# EAGLE board CFT-PB0-revD-TSSOP (EAGLE 5.11), part 1 of 2
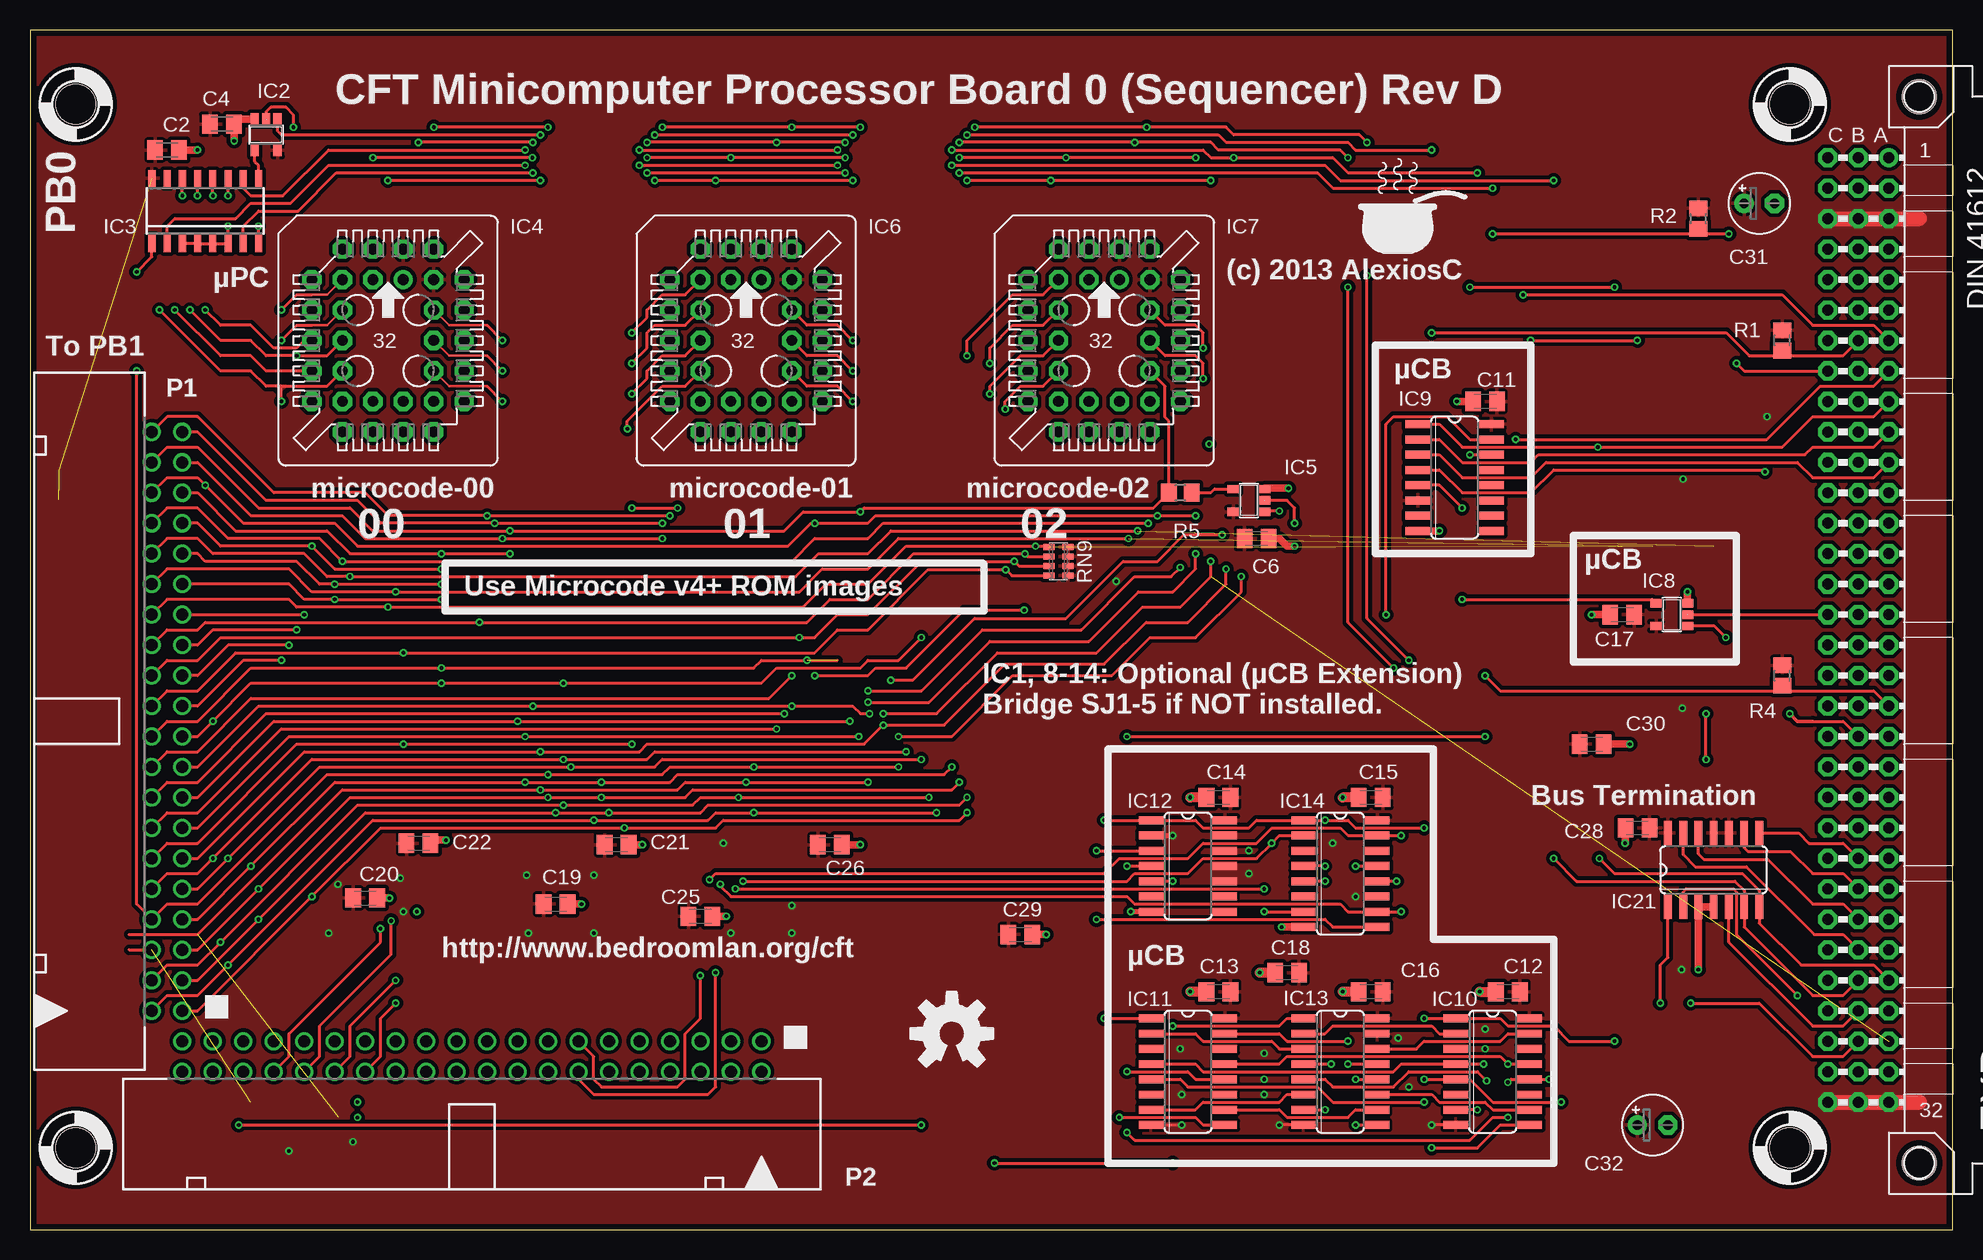
[diagram p5: board, top side]
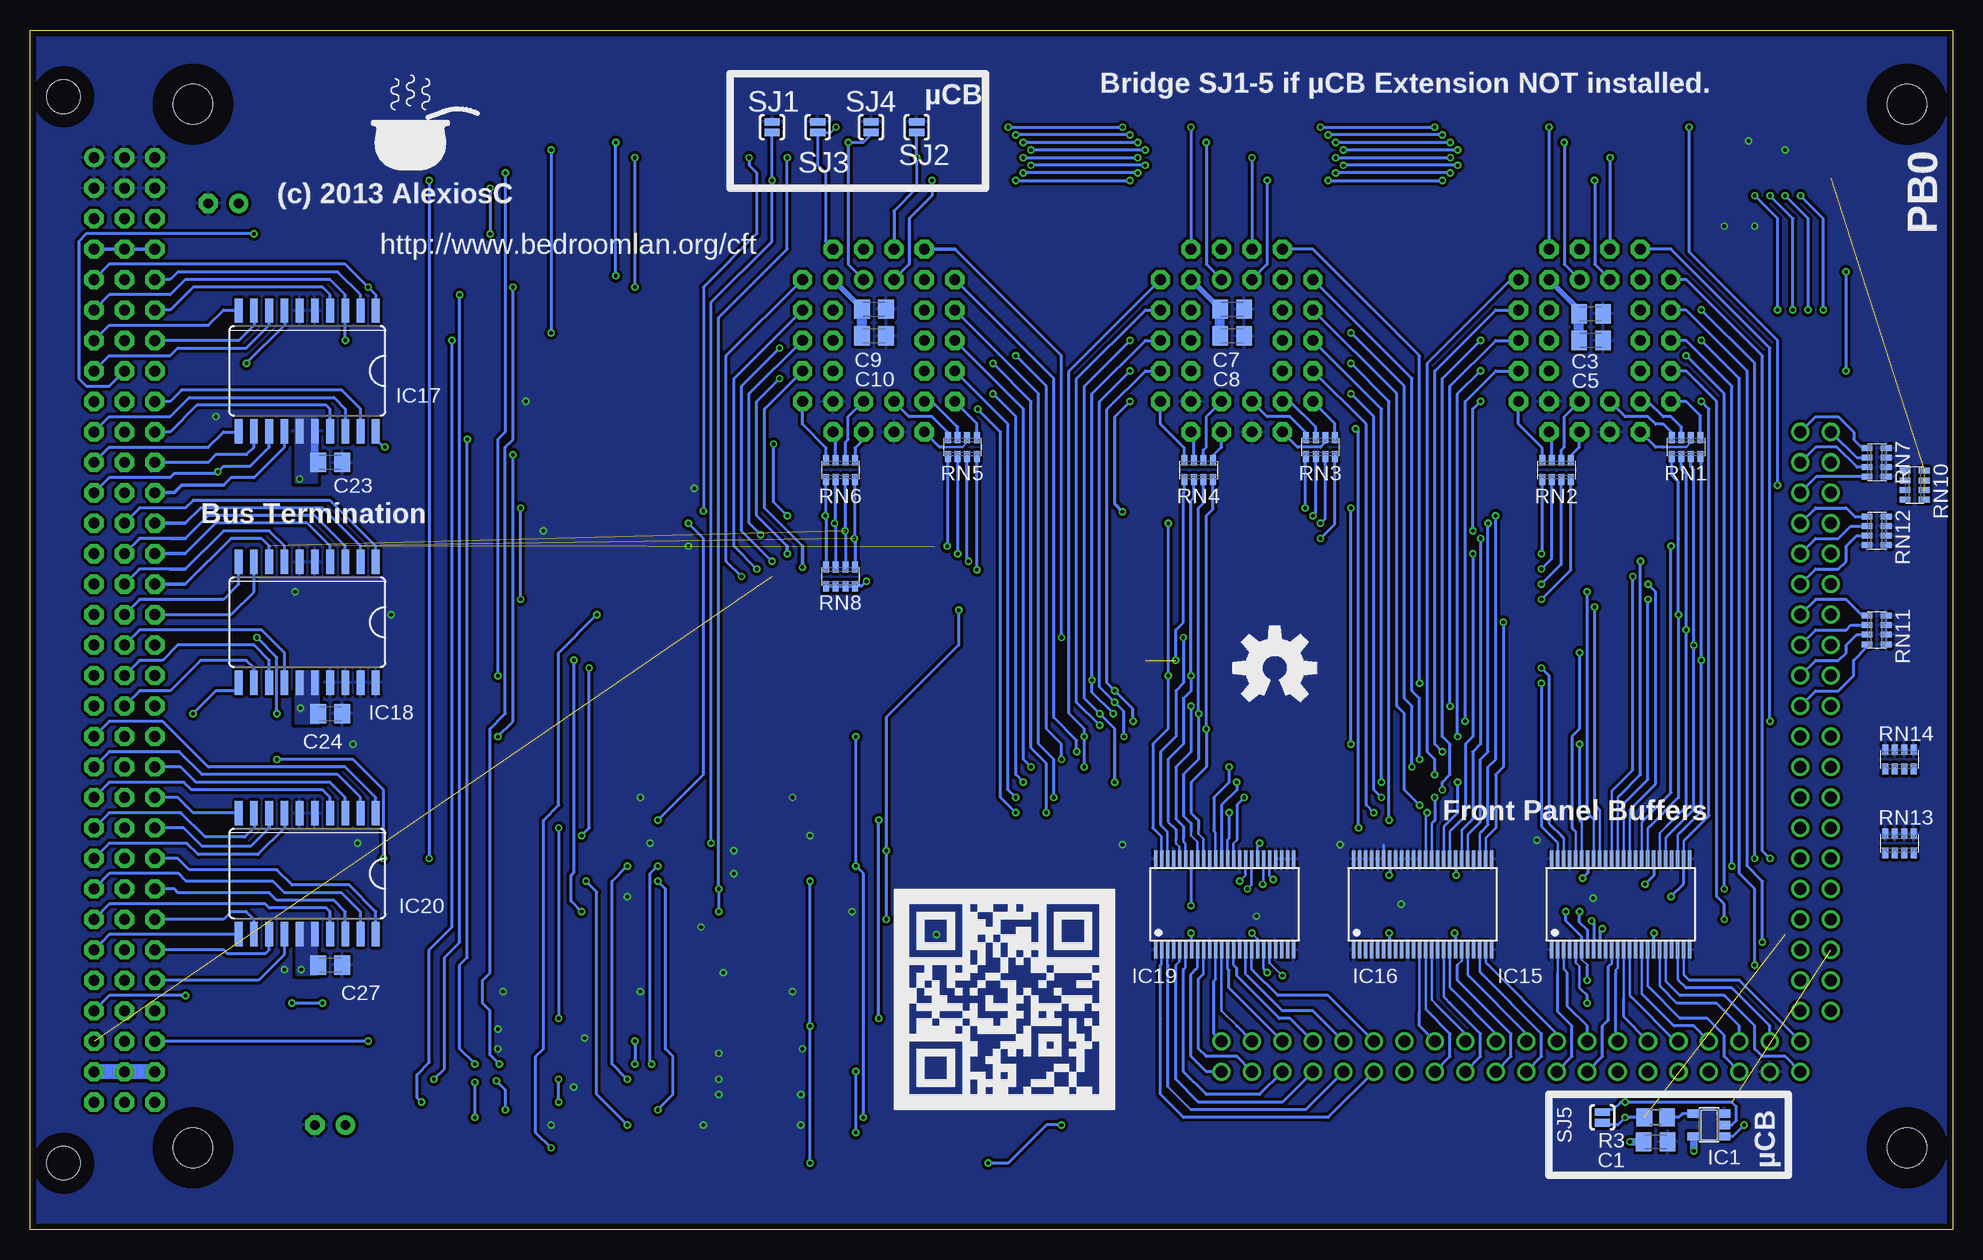
[diagram p6: board, bottom side, seen from below]

Size 160.27 x 100.03 mm. Coordinates in mm from the lower left corner, seen from the top.
Copper layers (1*16): Top 0.035mm / dielectric 1.5mm / Bottom 0.035mm
Design rules "smart-prototyping *": minimum track width 7mil, minimum drill 12mil, track to track 7mil, track to pad 7mil, pad to pad 7mil, via to via 7mil, smd to smd 0mil, copper to edge 20mil, drill to drill 10mil, minimum pad ring 10mil, minimum via ring 6mil, stop-mask expansion 2mil, vias tented up to drill 25mil, thermal gap 10mil
Net classes: 0 default: width 0.203 mm, clearance 0.152 mm; 1 low power: width 0.203 mm, clearance 0.152 mm; 2 LED power: width 1.93 mm, clearance 0.152 mm
bRestrict: area 39.6,22.1 to 40.1,22.6; area 59.2,22.1 to 59.7,22.6; area 23.1,22.1 to 23.6,22.6; area 39.6,31.7 to 40.1,32.2; area 23.1,31.7 to 23.6,32.2

## Footprints (pad centres in the part's own frame; a part is rotated, then mirrored left to right if it is on the bottom)
C0805K = smd 1.3 x 1.6: 1 -1,0; 2 1,0
E2,5-5 = drill 0.813 pad 1.6 round: + -1.27,0 | drill 0.813 pad 1.6 octagon: - 1.27,0
VG96K = drill 0.914 pad 1.6 round: A1 154.94,39.37 | drill 0.914 pad 1.6 octagon: A2 154.94,36.83; A3 154.94,34.29; A4 154.94,31.75; A5 154.94,29.21; A6 154.94,26.67; A7 154.94,24.13; A8 154.94,21.59; A9 154.94,19.05; A10 154.94,16.51; A11 154.94,13.97; A12 154.94,11.43; A13 154.94,8.89; A14 154.94,6.35; A15 154.94,3.81; A16 154.94,1.27; A17 154.94,-1.27; A18 154.94,-3.81; A19 154.94,-6.35; A20 154.94,-8.89; A21 154.94,-11.43; A22 154.94,-13.97; A23 154.94,-16.51; A24 154.94,-19.05; A25 154.94,-21.59; A26 154.94,-24.13; A27 154.94,-26.67; A28 154.94,-29.21; A29 154.94,-31.75; A30 154.94,-34.29; A31 154.94,-36.83; A32 154.94,-39.37; B1 152.4,39.37; B2 152.4,36.83; B3 152.4,34.29; B4 152.4,31.75; B5 152.4,29.21; B6 152.4,26.67; B7 152.4,24.13; B8 152.4,21.59; B9 152.4,19.05; B10 152.4,16.51; B11 152.4,13.97; B12 152.4,11.43; B13 152.4,8.89; B14 152.4,6.35; B15 152.4,3.81; B16 152.4,1.27; B17 152.4,-1.27; B18 152.4,-3.81; B19 152.4,-6.35; B20 152.4,-8.89; B21 152.4,-11.43; B22 152.4,-13.97; B23 152.4,-16.51; B24 152.4,-19.05; B25 152.4,-21.59; B26 152.4,-24.13; B27 152.4,-26.67; B28 152.4,-29.21; B29 152.4,-31.75; B30 152.4,-34.29; B31 152.4,-36.83; B32 152.4,-39.37; C1 149.86,39.37; C2 149.86,36.83; C3 149.86,34.29; C4 149.86,31.75; C5 149.86,29.21; C6 149.86,26.67; C7 149.86,24.13; C8 149.86,21.59; C9 149.86,19.05; C10 149.86,16.51; C11 149.86,13.97; C12 149.86,11.43; C13 149.86,8.89; C14 149.86,6.35; C15 149.86,3.81; C16 149.86,1.27; C17 149.86,-1.27; C18 149.86,-3.81; C19 149.86,-6.35; C20 149.86,-8.89; C21 149.86,-11.43; C22 149.86,-13.97; C23 149.86,-16.51; C24 149.86,-19.05; C25 149.86,-21.59; C26 149.86,-24.13; C27 149.86,-26.67; C28 149.86,-29.21; C29 149.86,-31.75; C30 149.86,-34.29; C31 149.86,-36.83; C32 149.86,-39.37 | hole 2.794: 157.48,44.45; 157.48,-44.45
SOT23-5 = smd 0.69 x 0.99: 1 -0.95,-1.29; 2 0,-1.29; 3 0.95,-1.29; 4 0.95,1.3; 5 -0.95,1.3
SO16D = smd 0.6 x 1.4: 1 -4.445,-2.715; 2 -3.175,-2.715; 3 -1.905,-2.715; 4 -0.635,-2.715; 5 0.635,-2.715; 6 1.905,-2.715; 7 3.175,-2.715; 8 4.445,-2.715; 9 4.445,2.715; 10 3.175,2.715; 11 1.905,2.715; 12 0.635,2.715; 13 -0.635,2.715; 14 -1.905,2.715; 15 -3.175,2.715; 16 -4.445,2.715
PLCC32 = drill 0.9 pad 1.6 round: 1 1.27,5.08 | drill 0.9 pad 1.6 octagon: 2 -1.27,7.62; 3 -1.27,5.08; 4 -3.81,7.62; 5 -6.35,5.08; 6 -3.81,5.08; 7 -6.35,2.54; 8 -3.81,2.54; 9 -6.35,0; 10 -3.81,0; 11 -6.35,-2.54; 12 -3.81,-2.54; 13 -6.35,-5.08; 14 -3.81,-7.62; 15 -3.81,-5.08; 16 -1.27,-7.62; 17 -1.27,-5.08; 18 1.27,-7.62; 19 1.27,-5.08; 20 3.81,-7.62; 21 6.35,-5.08; 22 3.81,-5.08; 23 6.35,-2.54; 24 3.81,-2.54; 25 6.35,0; 26 3.81,0; 27 6.35,2.54; 28 3.81,2.54; 29 6.35,5.08; 30 3.81,7.62; 31 3.81,5.08; 32 1.27,7.62
SO16 = smd 0.66 x 2.032: 1 -4.445,-3.073; 2 -3.175,-3.073; 3 -1.905,-3.073; 4 -0.635,-3.073; 5 0.635,-3.073; 6 1.905,-3.073; 7 3.175,-3.073; 8 4.445,-3.073; 9 4.445,3.073; 10 3.175,3.073; 11 1.905,3.073; 12 0.635,3.073; 13 -0.635,3.073; 14 -1.905,3.073; 15 -3.175,3.073; 16 -4.445,3.073
SO14 = smd 0.66 x 2.032: 1 -3.81,-3.073; 2 -2.54,-3.073; 3 -1.27,-3.073; 4 0,-3.073; 5 1.27,-3.073; 6 2.54,-3.073; 7 3.81,-3.073; 8 3.81,3.073; 9 2.54,3.073; 10 1.27,3.073; 11 0,3.073; 12 -1.27,3.073; 13 -2.54,3.073; 14 -3.81,3.073
TSSOP-48 = smd 0.28 x 1.43: 1 -5.49,-3.794; 2 -4.99,-3.794; 3 -4.49,-3.794; 4 -3.99,-3.794; 5 -3.49,-3.794; 6 -2.99,-3.794; 7 -2.49,-3.794; 8 -1.99,-3.794; 9 -1.49,-3.794; 10 -0.99,-3.794; 11 -0.49,-3.794; 12 0.01,-3.794; 13 0.51,-3.794; 14 1.01,-3.794; 15 1.51,-3.794; 16 2.01,-3.794; 17 2.51,-3.794; 18 3.01,-3.794; 19 3.51,-3.794; 20 4.01,-3.794; 21 4.51,-3.794; 22 5.01,-3.794; 23 5.51,-3.794; 24 6.01,-3.794; 25 6.01,3.756; 26 5.51,3.756; 27 5.01,3.756; 28 4.51,3.756; 29 4.01,3.756; 30 3.51,3.756; 31 3.01,3.756; 32 2.51,3.756; 33 2.01,3.756; 34 1.51,3.756; 35 1.01,3.756; 36 0.51,3.756; 37 0.01,3.756; 38 -0.49,3.756; 39 -0.99,3.756; 40 -1.49,3.756; 41 -1.99,3.756; 42 -2.49,3.756; 43 -2.99,3.756; 44 -3.49,3.756; 45 -3.99,3.756; 46 -4.49,3.756; 47 -4.99,3.756; 48 -5.49,3.756
SO20W = smd 0.66 x 2.032: 1 -5.715,-5.029; 2 -4.445,-5.029; 3 -3.175,-5.029; 4 -1.905,-5.029; 5 -0.635,-5.029; 6 0.635,-5.029; 7 1.905,-5.029; 8 3.175,-5.029; 9 4.445,-5.029; 10 5.715,-5.029; 11 5.715,5.029; 12 4.445,5.029; 13 3.175,5.029; 14 1.905,5.029; 15 0.635,5.029; 16 -0.635,5.029; 17 -1.905,5.029; 18 -3.175,5.029; 19 -4.445,5.029; 20 -5.715,5.029
PAK100/2500-5-40 = drill 1 pad 1.422 round: 1 -24.13,-1.27; 2 -24.13,1.27; 3 -21.59,-1.27; 4 -21.59,1.27; 5 -19.05,-1.27; 6 -19.05,1.27; 7 -16.51,-1.27; 8 -16.51,1.27; 9 -13.97,-1.27; 10 -13.97,1.27; 11 -11.43,-1.27; 12 -11.43,1.27; 13 -8.89,-1.27; 14 -8.89,1.27; 15 -6.35,-1.27; 16 -6.35,1.27; 17 -3.81,-1.27; 18 -3.81,1.27; 19 -1.27,-1.27; 20 -1.27,1.27; 21 1.27,-1.27; 22 1.27,1.27; 23 3.81,-1.27; 24 3.81,1.27; 25 6.35,-1.27; 26 6.35,1.27; 27 8.89,-1.27; 28 8.89,1.27; 29 11.43,-1.27; 30 11.43,1.27; 31 13.97,-1.27; 32 13.97,1.27; 33 16.51,-1.27; 34 16.51,1.27; 35 19.05,-1.27; 36 19.05,1.27; 37 21.59,-1.27; 38 21.59,1.27; 39 24.13,-1.27; 40 24.13,1.27
R0805 = smd 1.3 x 1.5: 1 -0.85,0; 2 0.85,0
R0805' = smd 1.3 x 1.5: 1 -0.95,0; 2 0.95,0
CTS742C083 = smd 0.5 x 0.9: 1 -1.2,-0.8; 2 -0.4,-0.8; 3 0.4,-0.8; 4 1.2,-0.8; 5 1.2,0.8; 6 0.4,0.8; 7 -0.4,0.8; 8 -1.2,0.8
SJ_2S-NO = smd 0.635 x 1.27: 1 -0.45,0; 2 0.45,0
STANDOFF_28_60 = hole 3.302: 0,0

## Placement (x,y rotation side)
$4_37_$  SIGNATURESILK  [SIGNATURE]  131.44,88.11 0 bottom
$4_39_$  OSHW-LOGOL  [OSHW-LOGO-L]  56.52,46.84 0 bottom
$4_40_$  QRCODE-CFT  [CFT-QRCODE]  88.27,10.01 0 bottom
C1  0.1uF  [C0805K]  24.77,7.34 0 bottom
C2  0.1uF  [C0805K]  11.43,90.02 0 top
C3  0.1uF  [C0805K]  30.16,76.37 0 bottom
C4  0.1uF  [C0805K]  16,92.18 0 top
C5  1uF  [C0805K]  30.16,74.14 0 bottom
C6  0.1uF  [C0805K]  102.23,57.63 0 top
C7  0.1uF  [C0805K]  60.07,76.75 0 bottom
C8  1uF  [C0805K]  60.07,74.52 0 bottom
C9  0.1uF  [C0805K]  89.92,76.75 0 bottom
C10  1uF  [C0805K]  89.92,74.52 0 bottom
C11  0.1uF  [C0805K]  121.28,69.06 180 top
C12  0.1uF  [C0805K]  123.19,19.85 180 top
C13  0.1uF  [C0805K]  99.06,19.85 180 top
C14  0.1uF  [C0805K]  99.06,36.04 180 top
C15  0.1uF  [C0805K]  111.76,36.04 180 top
C16  0.1uF  [C0805K]  111.76,19.85 180 top
C17  0.1uF  [C0805K]  132.72,51.28 180 top
C18  1uF  [C0805K]  104.78,21.44 180 top
C19  0.1uF  [C0805K]  43.81,27.15 0 top
C20  0.1uF  [C0805K]  27.94,27.66 0 top
C21  0.1uF  [C0805K]  48.9,32.11 0 top
C22  0.1uF  [C0805K]  32.38,32.23 0 top
C23  0.1uF  [C0805K]  135.25,63.98 0 bottom
C24  0.1uF  [C0805K]  135.25,43.03 0 bottom
C25  0.1uF  [C0805K]  55.88,26.14 0 top
C26  0.1uF  [C0805K]  66.67,32.11 0 top
C27  0.1uF  [C0805K]  135.25,22.07 0 bottom
C28  0.1uF  [C0805K]  133.99,33.5 180 top
C29  1uF  [C0805K]  82.55,24.61 0 top
C30  1uF  [C0805K]  130.18,40.49 0 top
C31  47uF  [E2,5-5]  144.15,85.57 0 top
C32  47uF  [E2,5-5]  135.25,8.74 0 top
EXP  [VG96K]  0,50.01 0 top
IC1  74AHC1G32DBV  [SOT23-5]  20.32,8.74 90 bottom
IC2  74AHC1G08DBV  [SOT23-5]  19.68,91.29 180 top
IC3  74HC161D  [SO16D]  14.61,84.94 0 top
IC4  29F040  [PLCC32]  29.84,74.14 0 top
IC5  74AHC1G00DBV  [SOT23-5]  101.6,60.81 90 top
IC6  29F040  [PLCC32]  59.69,74.14 0 top
IC7  29F040  [PLCC32]  89.53,74.14 0 top
IC8  74AHC1G32DBV  [SOT23-5]  136.84,51.28 90 top
IC9  74HC138D  [SO16]  118.75,62.71 270 top
IC10  74HC175D  [SO16]  121.92,13.18 270 top
IC11  74HC175D  [SO16]  96.52,13.18 270 top
IC12  74HC74D  [SO14]  96.52,30.33 270 top
IC13  74HC157D  [SO16]  109.22,13.18 270 top
IC14  74HC175D  [SO16]  109.22,29.69 270 top
IC15  74AC16244DGG  [TSSOP-48]  27.94,27.15 0 bottom
IC16  74AC16244DGG  [TSSOP-48]  44.45,27.15 0 bottom
IC17  SN74ACT1073  [SO20W]  137.16,71.6 180 bottom
IC18  SN74ACT1073  [SO20W]  137.16,50.65 180 bottom
IC19  74AC16244DGG  [TSSOP-48]  60.96,27.15 0 bottom
IC20  SN74ACT1073  [SO20W]  137.16,29.69 180 bottom
IC21  SN74ACT1071D  [SO14]  140.34,30.01 0 top
P1  2540-5  [PAK100/2500-5-40]  11.43,42.39 90 top
P2  2540-5  [PAK100/2500-5-40]  36.83,14.45 180 top
R1  4k7  [R0805]  146.05,74.14 90 top
R2  4k7  [R0805]  139.06,84.3 90 top
R3  30R  [R0805']  24.77,9.37 180 bottom
R4  4k7  [R0805]  146.05,46.2 90 top
R5  30R  [R0805']  95.89,61.44 180 top
RN1  30R  [CTS742C083]  22.23,65.25 180 bottom
RN2  30R  [CTS742C083]  33.02,63.35 180 bottom
RN3  30R  [CTS742C083]  52.7,65.25 180 bottom
RN4  30R  [CTS742C083]  62.87,63.35 180 bottom
RN5  30R  [CTS742C083]  82.55,65.25 180 bottom
RN6  30R  [CTS742C083]  92.71,63.35 180 bottom
RN7  10k  [CTS742C083]  6.35,63.98 270 bottom
RN8  10k  [CTS742C083]  92.71,54.46 180 bottom
RN9  10k  [CTS742C083]  85.72,55.73 270 top
RN10  10k  [CTS742C083]  3.17,62.08 270 bottom
RN11  10k  [CTS742C083]  6.35,50.01 270 bottom
RN12  10k  [CTS742C083]  6.35,58.27 270 bottom
RN13  10k  [CTS742C083]  4.45,32.23 0 bottom
RN14  10k  [CTS742C083]  4.45,39.22 0 bottom
SJ1  SOLDERJUMPER-OLDNO  [SJ_2S-NO]  98.42,91.92 270 bottom
SJ2  SOLDERJUMPER-OLDNO  [SJ_2S-NO]  86.36,91.92 270 bottom
SJ3  SOLDERJUMPER-OLDNO  [SJ_2S-NO]  94.61,91.92 270 bottom
SJ4  SOLDERJUMPER-OLDNO  [SJ_2S-NO]  90.17,91.92 270 bottom
SJ5  SOLDERJUMPER-OLDNO  [SJ_2S-NO]  29.21,9.37 90 bottom
U1  HOLE  [STANDOFF_28_60]  3.81,93.83 0 top
U2  HOLE  [STANDOFF_28_60]  3.81,6.83 0 top
U3  HOLE  [STANDOFF_28_60]  146.69,6.83 0 top
U4  HOLE  [STANDOFF_28_60]  146.69,93.83 0 top
U$1  SIGNATURESILK  [SIGNATURE]  111.12,81.13 0 top
U$3  OSHW-LOGOL  [OSHW-LOGO-L]  76.83,16.36 0 top